# Altium schematic sheet GD_Tcontroller_Sensor.SchDoc
size A4
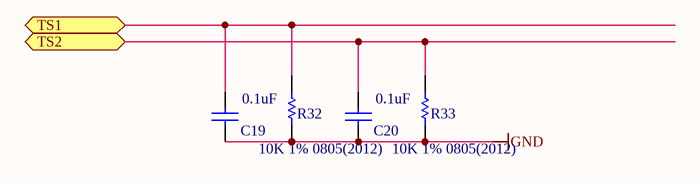
[diagram p0: GD_Tcontroller_Sensor.SchDoc]

## Parts
C19  value 0.1uF  [C0805]  (hidden comment: CAP 0.1uF 50V 0805(2012))
C20  value 0.1uF  [C0805]  (hidden comment: CAP 0.1uF 50V 0805(2012))
R32  10K 1% 0805(2012)  [R0805]  (no BOM)
R33  10K 1% 0805(2012)  [R0805]  (no BOM)

## Ports
TS1, TS2

## Nets
GND: C19.1 C20.1 R32.2 R33.2
TS1: C19.2 R32.1 ; port TS1
TS2: C20.2 R33.1 ; port TS2

## Library data of the parts
C19 C20 = CMP-1036-00070-1: CAP 0.1uF 50V ±20% 0805 (2012 Metric) Thickness 1mm SMD; Case-Metric: 2012; Case-EIA: 0805; Tolerance: 20%; Rated Voltage: 50 V; Technology: SMT; Max Thickness: 1 mm
R32 R33 = CMP-1013-00098-1: 10K 0.125W 5% 0805 (2012 Metric)  SMD; Case-EIA: 0805; Case-Metric: 2012; Value: 10000.00 Ohm; Power: 0.125 W; Technology: SMT; Tolerance: 1 %